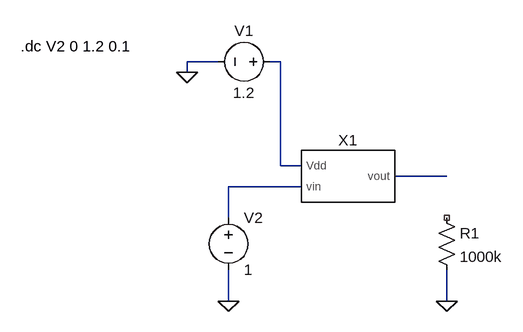
[diagram p0: schematic bias_bench.asc]
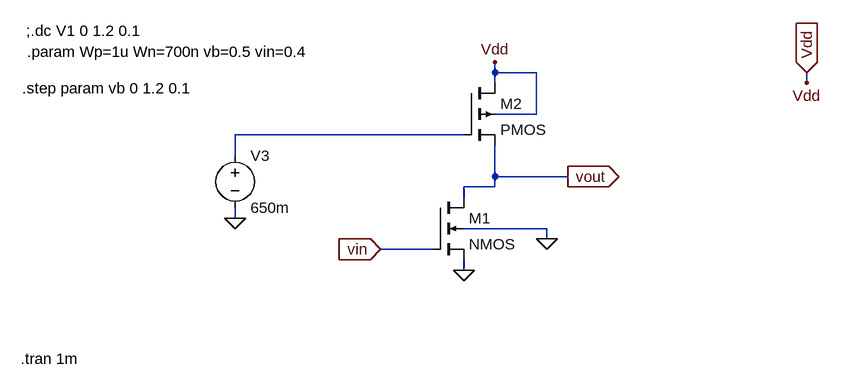
[diagram p1: sub-circuit bias_inverter.asc]
bias_bench.asc, the LTspice schematic file:
Version 4
SHEET 1 880 680
WIRE 16 0 -32 0
WIRE 112 0 96 0
WIRE -32 16 -32 0
WIRE 112 160 112 0
WIRE 144 160 112 160
WIRE 368 176 288 176
WIRE 144 192 32 192
WIRE 32 240 32 192
WIRE 32 368 32 320
WIRE 368 368 368 320
FLAG -32 16 0
FLAG 368 368 0
FLAG 32 368 0
SYMBOL bias_inverter 208 176 R0
SYMATTR InstName X1
SYMBOL voltage 112 0 R90
WINDOW 0 -32 56 VBottom 2
WINDOW 3 32 56 VTop 2
WINDOW 123 0 0 Left 0
WINDOW 39 0 0 Left 0
SYMATTR InstName V1
SYMATTR Value 1.2
SYMBOL voltage 32 224 R0
WINDOW 123 0 0 Left 0
WINDOW 39 0 0 Left 0
SYMATTR InstName V2
SYMATTR Value 1
SYMBOL res 352 224 R0
SYMATTR InstName R1
SYMATTR Value 1000k
TEXT -288 -24 Left 2 !.dc V2 0 1.2 0.1

bias_inverter.asc, the sub-circuit schematic file:
Version 4
SHEET 1 880 680
WIRE -2992 -32416 -2992 -32432
WIRE -2928 -32416 -2992 -32416
WIRE -2992 -32400 -2992 -32416
WIRE -2512 -32400 -2512 -32416
WIRE -2928 -32352 -2928 -32416
WIRE -2928 -32352 -2992 -32352
WIRE -3040 -32320 -3392 -32320
WIRE -3392 -32288 -3392 -32320
WIRE -2992 -32256 -2992 -32304
WIRE -2880 -32256 -2992 -32256
WIRE -2992 -32240 -2992 -32256
WIRE -2992 -32240 -3040 -32240
WIRE -3040 -32224 -3040 -32240
WIRE -3392 -32192 -3392 -32208
WIRE -2912 -32176 -3040 -32176
WIRE -2912 -32160 -2912 -32176
WIRE -3088 -32144 -3168 -32144
WIRE -3040 -32112 -3040 -32128
FLAG -3040 -32112 0
FLAG -2912 -32160 0
FLAG -2992 -32432 Vdd
FLAG -2512 -32416 Vdd
IOPIN -2512 -32416 In
FLAG -3392 -32192 0
FLAG -3168 -32144 vin
IOPIN -3168 -32144 In
FLAG -2880 -32256 vout
IOPIN -2880 -32256 Out
FLAG -2512 -32400 Vdd
SYMBOL nmos4 -3088 -32224 R0
SYMATTR InstName M1
SYMATTR Value2 l=1u w=Wn
SYMBOL pmos4 -3040 -32400 R0
SYMATTR InstName M2
SYMATTR Value2 l=400n w=Wp
SYMBOL voltage -3392 -32304 R0
WINDOW 123 0 0 Left 0
WINDOW 39 0 0 Left 0
SYMATTR InstName V3
SYMATTR Value 650m
TEXT -3714 -32480 Left 2 !;.dc V1 0 1.2 0.1
TEXT -3712 -32448 Left 2 !.param Wp=1u Wn=700n vb=0.5 vin=0.4
TEXT -3720 -32392 Left 2 !.step param vb 0 1.2 0.1
TEXT -3722 -31976 Left 2 !.tran 1m

The netlist it stands for:
* bias_bench.asc
XX1 N001 N003 N002 bias_inverter
V1 N001 0 1.2
V2 N003 0 1
R1 NC_01 0 1000k

* block symbol definitions
.subckt bias_inverter Vdd vin vout
M1 vout vin 0 0 NMOS l=1u w=Wn
M2 Vdd N001 vout Vdd PMOS l=400n w=Wp
V3 N001 0 650m
;.dc V1 0 1.2 0.1
.param Wp=1u Wn=700n vb=0.5 vin=0.4
.step param vb 0 1.2 0.1
.tran 1m
.ends bias_inverter

.model NMOS NMOS
.model PMOS PMOS
.lib standard.mos
.dc V2 0 1.2 0.1
.backanno
.end